# Altium schematic sheet Sheet3.SchDoc
size A3; SheetNumber: 3; SheetTotal: 3
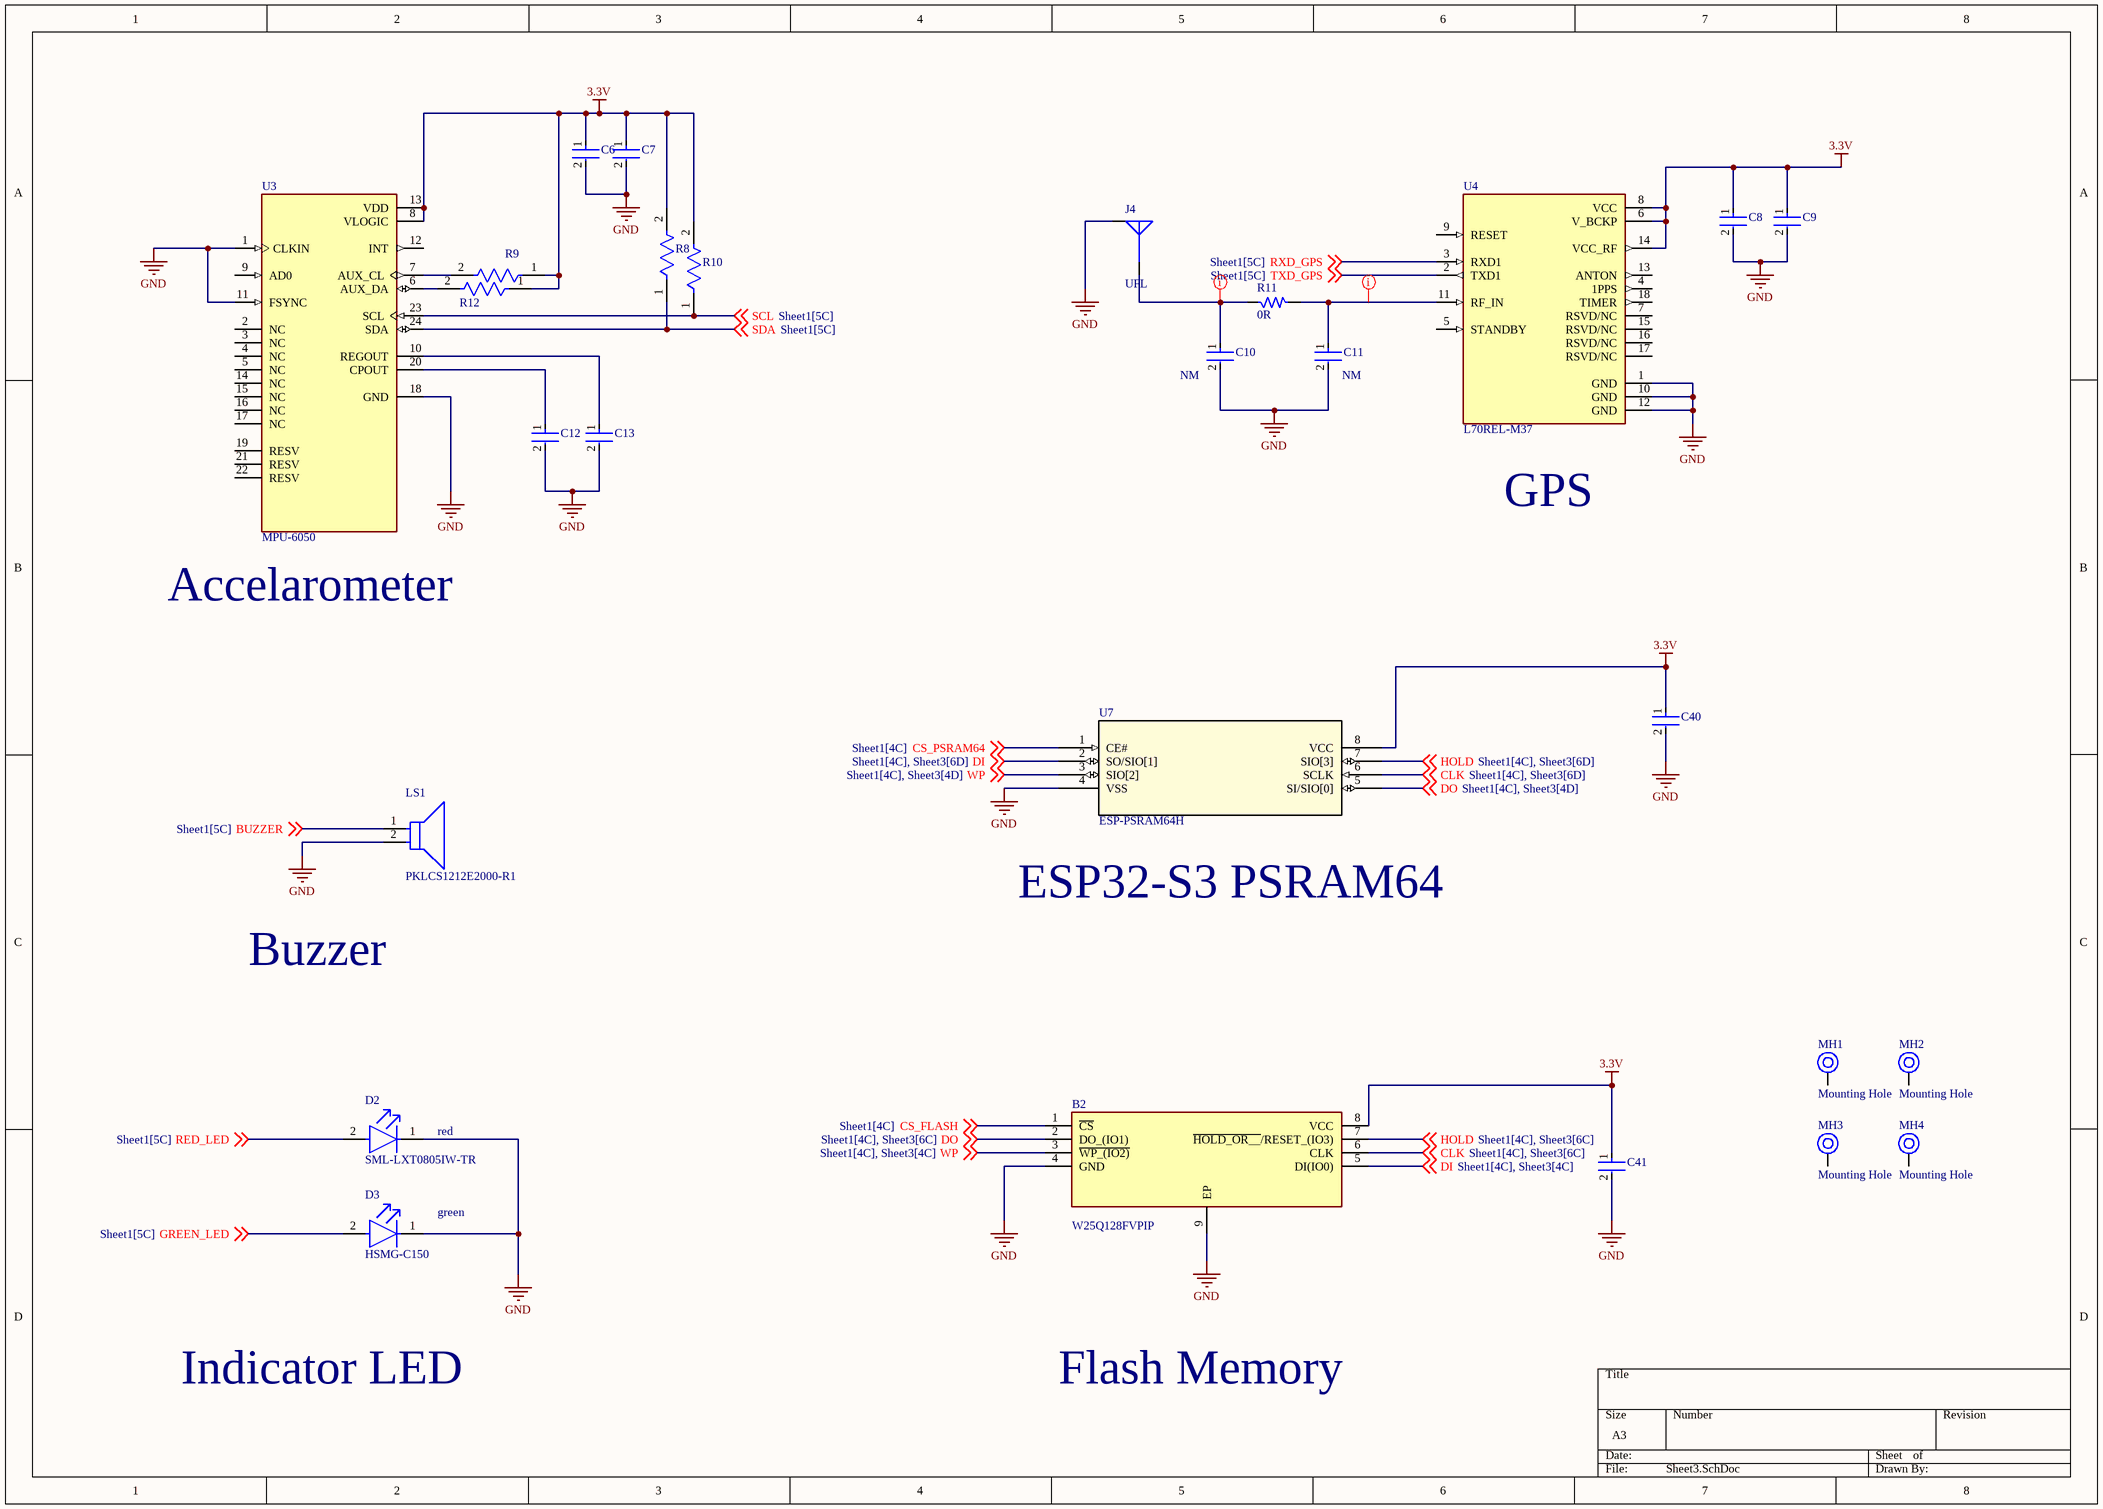
[diagram p0: Sheet3.SchDoc]

## Parts
B2  W25Q128FVPIP  [SON127P600X500X80-9N-D]
C6  C0402C104K4RACTU  [FP-C0402-BB-MFG]  (value not drawn)
C7  C0402C104K4RACTU  [FP-C0402-BB-MFG]  (value not drawn)
C8  C0402C104K4RACTU  [FP-C0402-BB-MFG]  (value not drawn)
C9  C0402C104K4RACTU  [FP-C0402-BB-MFG]  (value not drawn)
C10  04025C222KAT2A  [FP-0402-L_1_0_1-W_0_5_0_1-MFG]  (value not drawn)
C11  C0402C104K4RACTU  [FP-C0402-BB-MFG]  (value not drawn)
C12  04025C222KAT2A  [FP-0402-L_1_0_1-W_0_5_0_1-MFG]  (value not drawn)
C13  C0402C104K4RACTU  [FP-C0402-BB-MFG]  (value not drawn)
C40  C0402C104K4RACTU  [FP-C0402-BB-MFG]  (value not drawn)
C41  C0402C104K4RACTU  [FP-C0402-BB-MFG]  (value not drawn)
D2  SML-LXT0805IW-TR  [FP-SML-LXT0805IW-TR-MFG]
D3  HSMG-C150  [FP-HSMG-C150-MFG]
J4  UFL  [MOLEX SD-734120110]
LS1  PKLCS1212E2000-R1  [FP-PKLCS1212E2000-R1-MFG]
MH1  Mounting Hole  [MOUNTING]
MH2  Mounting Hole  [MOUNTING]
MH3  Mounting Hole  [MOUNTING]
MH4  Mounting Hole  [MOUNTING]
R8  CRCW04024K70FKED  [FP-CRCW0402-e3-IPC_B]  (value not drawn)
R9  CRCW04024K70FKED  [FP-CRCW0402-e3-IPC_B]  (value not drawn)
R10  CRCW04024K70FKED  [FP-CRCW0402-e3-IPC_B]  (value not drawn)
R11  0R  [RES_0805]
R12  CRCW04024K70FKED  [FP-CRCW0402-e3-IPC_B]  (value not drawn)
U3  MPU-6050  [QFN50P400X400X95-24N]
U4  L70REL-M37  [XCVR_L70REL-M37]
U7  ESP-PSRAM64H  [SOP8-150MIL_ADA]

## Nets
3.3V: B2.8(VCC) C6.1 C7.1 C8.1 C9.1 C40.1 C41.1 R8.2 R9.1 R10.2 R12.1 U3.8(VLOGIC) U3.13(VDD) U4.6(V_BCKP) U4.8(VCC) U4.14(VCC_RF) U7.8(VCC)
GND: B2.4(GND) B2.9(EP) C6.2 C7.2 C8.2 C9.2 C10.2 C11.2 C12.2 C13.2 C40.2 C41.2 D2.1(C) D3.1(C) J4.G LS1.2 U3.1(CLKIN) U3.11(FSYNC) U3.18(GND) U4.1(GND) U4.10(GND) U4.12(GND) U7.4(VSS)
BUZZER: LS1.1 ; off-sheet BUZZER
CLK: B2.6(CLK) U7.6(SCLK) ; off-sheet CLK
CS_FLASH: B2.1(~{CS}) ; off-sheet CS_FLASH
CS_PSRAM64: U7.1(CE#) ; off-sheet CS_PSRAM64
DI: B2.5(DI(IO0)) U7.2(SO/SIO[1]) ; off-sheet DI
DO: B2.2(DO_(IO1)) U7.5(SI/SIO[0]) ; off-sheet DO
GREEN_LED: D3.2(A) ; off-sheet GREEN_LED
HOLD: B2.7(~{HOLD_OR__}/RESET_(IO3)) U7.7(SIO[3]) ; off-sheet HOLD
RED_LED: D2.2(A) ; off-sheet RED_LED
RXD_GPS: U4.3(RXD1) ; off-sheet RXD_GPS
SCL: R10.1 U3.23(SCL) ; off-sheet SCL
SDA: R8.1 U3.24(SDA) ; off-sheet SDA
TXD_GPS: U4.2(TXD1) ; off-sheet TXD_GPS
WP: B2.3(~{WP_(IO2)}) U7.3(SIO[2]) ; off-sheet WP
NetC10_1: C10.1 J4.S R11.1
NetC11_1: C11.1 R11.2 U4.11(RF_IN)
NetC12_1: C12.1 U3.20(CPOUT)
NetC13_1: C13.1 U3.10(REGOUT)
NetR9_2: R9.2 U3.7(AUX_CL)
NetR12_2: R12.2 U3.6(AUX_DA)

Not connected (* = marked no-connect by the designer): MH1 1; MH2 1; MH3 1; MH4 1; U3 2(NC) 3(NC) 4(NC) 5(NC) 9(AD0) 12(INT) 14(NC) 15(NC) 16(NC) 17(NC) 19(RESV) 21(RESV) 22(RESV); U4 4(1PPS) 5(STANDBY) 7(RSVD/NC) 9(RESET) 13(ANTON) 15(RSVD/NC) 16(RSVD/NC) 17(RSVD/NC) 18(TIMER)

## Layout directives
net class 50ohm_gps; rule Width Constraint [Pref Impedance = 50.00ohms    Min Impedance = 50.00ohms    Max Impedance = 50.00ohms]: NetC10_1, NetC11_1

## Notes on the sheet
- (near C10) NM
- (near C11) NM
- GPS
- Accelarometer
- ESP32-S3 PSRAM64
- Buzzer
- (near D2) red
- (near D3) green
- Indicator LED
- Flash Memory

## Library data of the parts
B2 = W25Q128FVPIP: 3V 128M-BIT Serial Flash Memory With Dual/Quad SPI & QPI; Manufacturer_Name: Winbond; Geometry.Height: 0.8mm; Manufacturer_Part_Number: W25Q128FVPIP; Mouser Part Number: *; Mouser Price/Stock: *; Arrow Part Number: *; Arrow Price/Stock: *; Datasheet Link: *
C6-C9 C11 C13 C40 C41 = CMP-2008-02108-2: CAP CER 0.1UF 16V X7R 0402; Manufacturer: Kemet; Value: 0.10 μF; Tolerance: 0.1; Material: Ceramic; Temperature Coefficient: 15%; Voltage Rating: 16 V; Package: C0402-BB; Automotive: No; Ipc Land Pattern Name: CAPC10050X50; Device Class L3: Ceramic Capacitors; Capacitance: 0.10 μF; Octopart: https://octopart.com/c0402c104k4ractu-kemet-94158; Temperature Characteristic: X7R; Mouser Description: Cap Ceramic 0.1uF 16V X7R 10% SMD 0402 125?C Paper T/R - Tape and Reel (Alt: C0402C104K4RAC TU); ComponentLink2Description: Datasheet; Temperature Range Low: -55°C; RoHS: TRUE; Device Class L1: Passive Components; Manufacturer Part Number: C0402C104K4RACTU; Temperature Range High: +125°C; Device Class L2: Capacitors; ComponentLink2URL: https://content.kemet.com/datasheets/KEM_C1002_X7R_SMD.pdf; Category: Cap; Height: 0.55mm; Temperature: -55°C to +125°C; Lead Free: Yes; Digikey Description: CAP CER 0.1UF 16V X7R 0402
C10 C12 = CMP-2008-02711-2: General Purpose Ceramic Capacitor, 0402, 2.2nF, 10%, X7R, 15%, 50V; Voltage: 50V; Case/Package: 0402; Length: 1mm; Mount: Surface Mount; Series: -; Dielectric Material: Ceramic; Termination: SMD/SMT; Dielectric: X7R; Width: 0.02inch; Tolerance: 10%; Contact Plating: Tin; Radiation Hardening: No; Case Code (Imperial): 0402; Packaging: Tape and Reel; Number of Pins: 2; Case Code (Metric): 1005; Lead Free: Lead Free; Thickness: 0.022inch; Height: 0.56mm; Voltage Rating: 50V; RoHS Compliant: Yes; Capacitance: 2.2nF; Depth: 0.5mm; Voltage Rating (DC): 50V; Max Operating Temperature: 125°C; Construction: Flat; Min Operating Temperature: -55°C; Package Quantity: 1; REACH SVHC: No SVHC
D2 = CMP-1724-00002-2: LED RED DIFFUSED SMD; Lens Style: Rectangular; Luminous Intensity: 11mcd; Approvals: UL; Test Current: 20mA; Forward Voltage: 2V; Number of LEDs: 1; Wavelength: 635nm; Lens Color: White; Viewing Angle: 140°; Min Operating Temperature: -25°C; Case Code (Metric): 2012; Mount: Surface Mount; Case Code (Imperial): 0805; Height: 0.8mm; Lead Free: Lead Free; Color: Red; Package Quantity: 1; Illumination Color: Red; Lens Transparency: Diffused; Forward Current: 20mA; Packaging: Tape and Reel; Length: 2mm; Case/Package: 0805; REACH SVHC: No SVHC; Width: 1.25mm; Number of Pins: 2; Max Operating Temperature: 80°C; Dominant Wavelength: 635nm
D3 = CMP-2000-05061-2: LED GREEN DIFFUSED 1206 SMD; Manufacturer: Broadcom; Led Orientation: Top View; Max Junction Temp: +95°C; Peak Emmision Wavelength: 570nm; Viewing Angle: 170°; Wavelength: 572nm; Reverse Voltage: 5V; Luminous Intensity: 15mcd; Forward Voltage: 2.2V; Power Dissipation: 65mW; Forward Current: 20mA; ComponentLink2Description: Datasheet; Lead Free: Yes; Temperature Range Low: -40°C; Package: HSMG-C150; Digikey Description: LED GREEN DIFFUSED 1206 SMD; Mouser Description: LED Uni-Color Green 570nm 2-Pin Chip LED T/R; Manufacturer Part Number: HSMG-C150; Temperature Range High: +85°C; Device Class L1: Optoelectronics; Colour: Green; Category: Diode; Device Class L3: unset; RoHS: TRUE; Height: 1.2mm; ComponentLink2URL: https://docs.broadcom.com/docs/AV02-0551EN; Device Class L2: LEDs; Automotive: No; Ipc Land Pattern Name: DIOCP320160X55; Octopart: https://octopart.com/hsmg-c150-broadcom-71131304; Temperature: -40°C to +85°C
J4 = UFL MOLEX SD-734120110: PartNumber: MOLEX SD-734120110
LS1 = CMP-06202-000001-1: AUDIO PIEZO TRANSDUCER 12.5V SMD; Manufacturer: Murata; Frequency: 2kHz; Digikey Description: AUDIO PIEZO TRANSDUCER 12.5V SMD; RoHS: TRUE; Device Class L3: Buzzers; Manufacturer Part Number: PKLCS1212E2000-R1; Automotive: No; Category: Speak; Height: 3mm; Operating Supply Voltage: 12.5V; Mouser Description: Piezo buzzer SMD; Temperature Range High: +70°C; Temperature Range Low: -20°C; ComponentLink2Description: Datasheet; ComponentLink2URL: https://www.murata.com/en-global/products/productdata/8801054425118/SPEC-PKLCS1212E2000-R1.pdf?1517839212000; Package: PKLCS1212E2000-R1; Device Class L1: Electromechanical; Device Class L2: Audio Products; Lead Free: Yes; Temperature: -20°C to +70°C; Octopart: https://octopart.com/pklcs1212e2000-r1-murata-7123179
MH1-MH4 = MH_3.5H_6D: Manufacturer Part Number: NA; Case/Package: TH; Manufacturer: NA; Supplier-1: NA; Supplier Part Number-1: NA; Alternate Part Number-1: NA
R8-R10 R12 = CMP-2002-00051-3: RES Thick Film, 4.7kΩ, 1%, 0.063W, 100ppm/°C, 0402; Voltage Rating (DC): 50V; Power Rating: 63mW; Resistance: 4.7kR; Termination: SMD/SMT; Military Standard: Not; Length: 1mm; Radiation Hardening: No; Max Operating Temperature: 155°C; Min Operating Temperature: -55°C; Package Quantity: 10; Width: 0.5mm; Case Code (Imperial): 0402; Number of Terminations: 2; Max Power Dissipation: 63mW; Tolerance: 1%; Features: Automotive AEC-Q200; Composition: Thick Film; Depth: 0.5mm; Mount: Surface Mount; Weight: 2.3E-05oz; Lead Free: Lead Free; Case/Package: 0402; Height: 0.35mm; Packaging: Tape and Reel; Temperature Coefficient: 100ppm/°C; Case Code (Metric): 1005; Voltage Rating: 50V; Contact Plating: Tin
R11 = RES_0R-0.125W-1%-0805: 0 Ohms Jumper 0.125W, 1/8W Chip Resistor 0805 (2012 Metric) Automotive AEC-Q200 Thick Film; Manufacturer: Walsin; Manufacturer Part Number: WR08X000PTL; Case/Package: 0805; Supplier-1: SIRICOM; Supplier Part Number-1: WR08X000PTL; Alternate Part Number-1: WR08X000PTL
U3 = MPU-6050: MPU-6050 series Accelerometer, Gyroscope, 3 Axis Sensor Evaluation Board; MF: TDK InvenSense; SnapEDA_Link: https://www.snapeda.com/parts/MPU-6050/TDK+InvenSense/view-part/?ref=snap; Package: QFN-24 InvenSense; Value: *; MP: MPU-6050; Check_prices: https://www.snapeda.com/parts/MPU-6050/TDK+InvenSense/view-part/?ref=eda
U4 = L70REL-M37: Navigation GPS Transceiver Module 1.575GHz Antenna Not Included Surface Mount; MF: Quectel; Package: NON STANDARD-18 Quectel; Price: None; Check_prices: https://www.snapeda.com/parts/L70REL-M37/Quectel/view-part/?ref=eda; Value: *; SnapEDA_Link: https://www.snapeda.com/parts/L70REL-M37/Quectel/view-part/?ref=snap; MP: L70REL-M37; Availability: In Stock; Purchase-URL: https://pricing.snapeda.com/search?q=L70REL-M37&ref=eda
U7 = ESPRESSIF ESP-PSRAM64H: No Description Available; Mfr_Name: Adafruit Industries; RefDes: RefDes; Type: Type